# Altium schematic sheet 24GSchematic.SchDoc
size A4
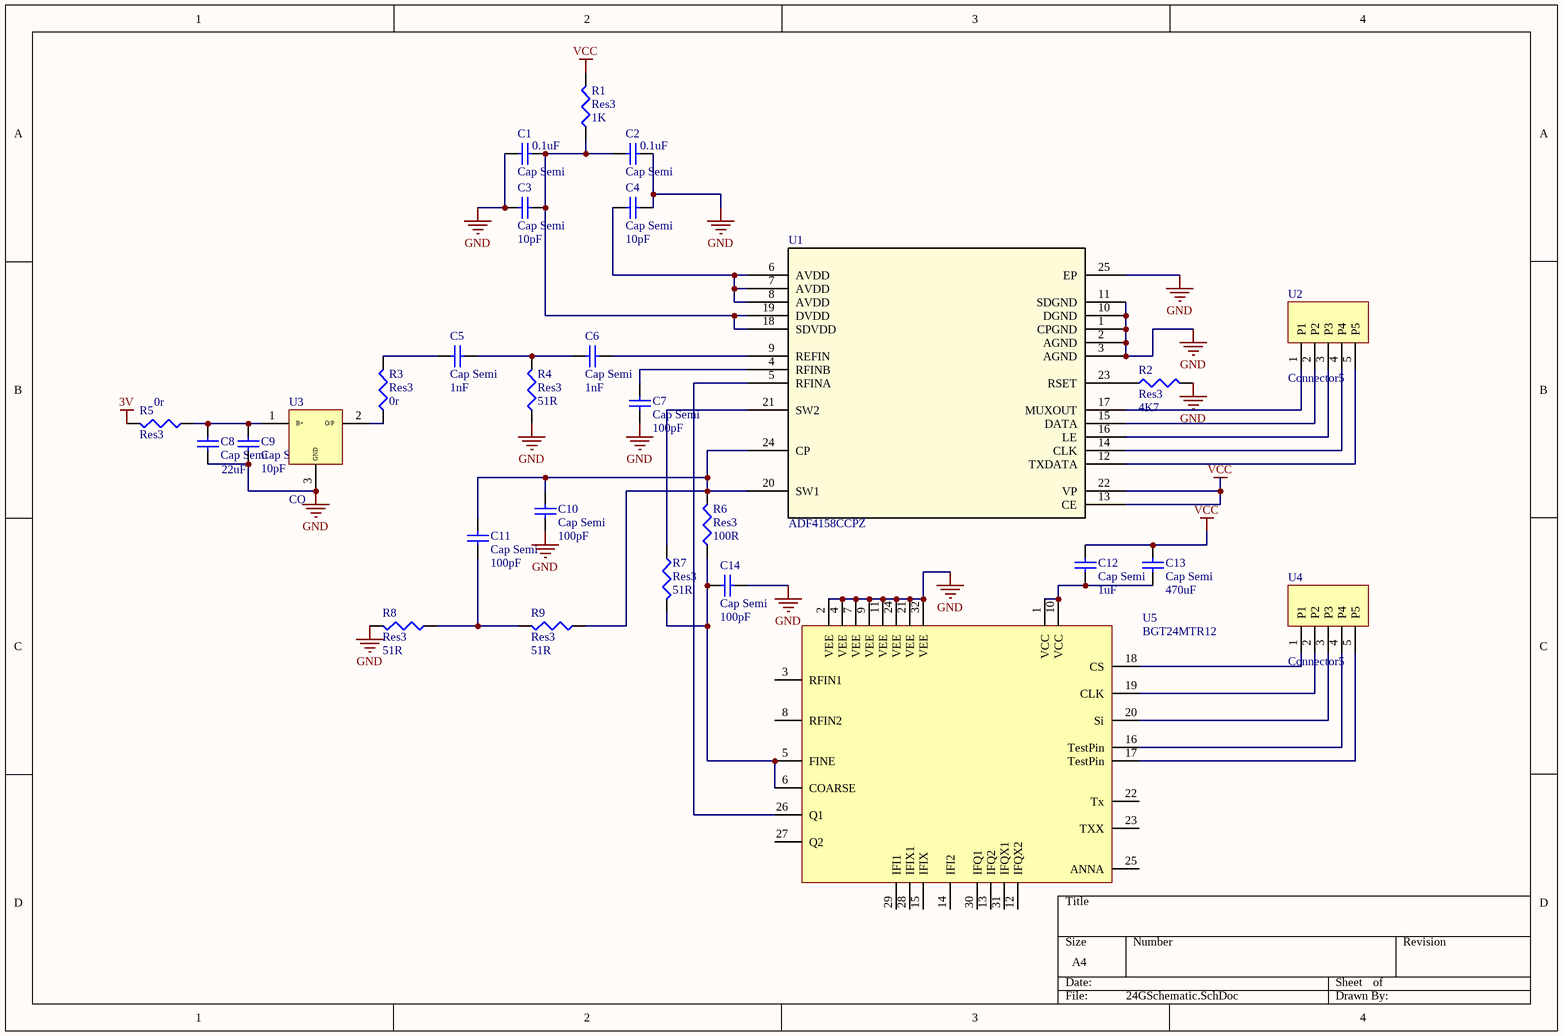
[diagram p0: 24GSchematic.SchDoc]

## Parts
C1  Cap Semi  value 0.1uF  [1608[0603]]
C2  Cap Semi  value 0.1uF  [1608[0603]]
C3  Cap Semi  value 10pF  [1608[0603]]
C4  Cap Semi  value 10pF  [1608[0603]]
C5  Cap Semi  value 1nF  [1608[0603]]
C6  Cap Semi  value 1nF  [1608[0603]]
C7  Cap Semi  value 100pF  [1608[0603]]
C8  Cap Semi  value 22uF  [1608[0603]]
C9  Cap Semi  value 10pF  [1608[0603]]
C10  Cap Semi  value 100pF  [1608[0603]]
C11  Cap Semi  value 100pF  [1608[0603]]
C12  Cap Semi  value 1uF  [1608[0603]]
C13  Cap Semi  value 470uF  [1608[0603]]
C14  Cap Semi  value 100pF  [1608[0603]]
R1  Res3  value 1K  [J1-0603]
R2  Res3  value 4K7  [J1-0603]
R3  Res3  value 0r  [J1-0603]
R4  Res3  value 51R  [J1-0603]
R5  Res3  value 0r  [J1-0603]
R6  Res3  value 100R  [J1-0603]
R7  Res3  value 51R  [J1-0603]
R8  Res3  value 51R  [J1-0603]
R9  Res3  value 51R  [J1-0603]
U1  ADF4158CCPZ  [CP_24_7]
U2  Connector5  [Connector5P - duplicate]
U3  CO  [FOX801BE-100]
U4  Connector5  [Connector5P - duplicate]
U5  BGT24MTR12  [QFN50P540X440X90_HS-33N]

## Nets
3V: R5.2
GND: C1.1 C2.2 C3.1 C4.2 C7.1 C8.1 C9.1 C10.2 C14.1 R2.2 R4.1 R8.2 U1.1(CPGND) U1.2(AGND) U1.3(AGND) U1.10(DGND) U1.11(SDGND) U1.25(EP) U3.3(GND) U5.2(VEE) U5.4(VEE) U5.7(VEE) U5.9(VEE) U5.11(VEE) U5.21(VEE) U5.24(VEE) U5.32(VEE)
VCC: C12.1 C13.1 R1.1 U1.13(CE) U1.22(VP)
NetC1_2: C1.2 C2.1 C3.2 R1.2 U1.18(SDVDD) U1.19(DVDD)
NetC4_1: C4.1 U1.6(AVDD) U1.7(AVDD) U1.8(AVDD)
NetC5_1: C5.1 R3.2
NetC5_2: C5.2 C6.1 R4.2
NetC6_2: C6.2 U1.9(REFIN)
NetC7_2: C7.2 U1.4(RFINB)
NetC8_2: C8.2 C9.2 R5.1 U3.1(B+)
NetC10_1: C10.1 C11.2 R6.2 R9.1 U1.20(SW1) U1.24(CP)
NetC11_1: C11.1 R8.1 R9.2
NetC12_2: C12.2 C13.2 U5.1(VCC) U5.10(VCC)
NetC14_2: C14.2 R6.1 R7.2 U5.5(FINE) U5.6(COARSE)
NetR2_1: R2.1 U1.23(RSET)
NetR3_1: R3.1 U3.2(O/P)
NetR7_1: R7.1 U1.21(SW2)
NetU1_5: U1.5(RFINA) U5.26(Q1)
NetU1_12: U1.12(TXDATA) U2.5(P5)
NetU1_14: U1.14(CLK) U2.4(P4)
NetU1_15: U1.15(DATA) U2.2(P2)
NetU1_16: U1.16(LE) U2.3(P3)
NetU1_17: U1.17(MUXOUT) U2.1(P1)
NetU4_1: U4.1(P1) U5.18(CS)
NetU4_2: U4.2(P2) U5.19(CLK)
NetU4_3: U4.3(P3) U5.20(Si)
NetU4_4: U4.4(P4) U5.16(TestPin)
NetU4_5: U4.5(P5) U5.17(TestPin)

Not connected (* = marked no-connect by the designer): U5 3(RFIN1) 8(RFIN2) 12(IFQX2) 13(IFQ2) 14(IFI2) 15(IFIX) 22(Tx) 23(TXX) 25(ANNA) 27(Q2) 28(IFIX1) 29(IFI1) 30(IFQ1) 31(IFQX1)

## Library data of the parts
C1-C14 = Cap Semi: Capacitor (Semiconductor SIM Model); Published: 8-Jun-2000; LatestRevisionDate: 29-May-2009; LatestRevisionNote: IPC-7351 Footprint Added.; PackageReference: C1206; Publisher: Altium Limited; PackageDescription: Chip Capacitor
R1-R9 = Res3: Resistor; Published: 8-Jun-2000; LatestRevisionDate: 29-May-2009; LatestRevisionNote: IPC-7351 Footprint Added.; PackageReference: J1-0603; Publisher: Altium Limited; PackageDescription: Chip Resistor
U1 = ADF4158CCPZ: Imported; RefDes: RefDes; Type: Type; Value: Value